# EAGLE design ItalyMap-10 (EAGLE 9.6.2)
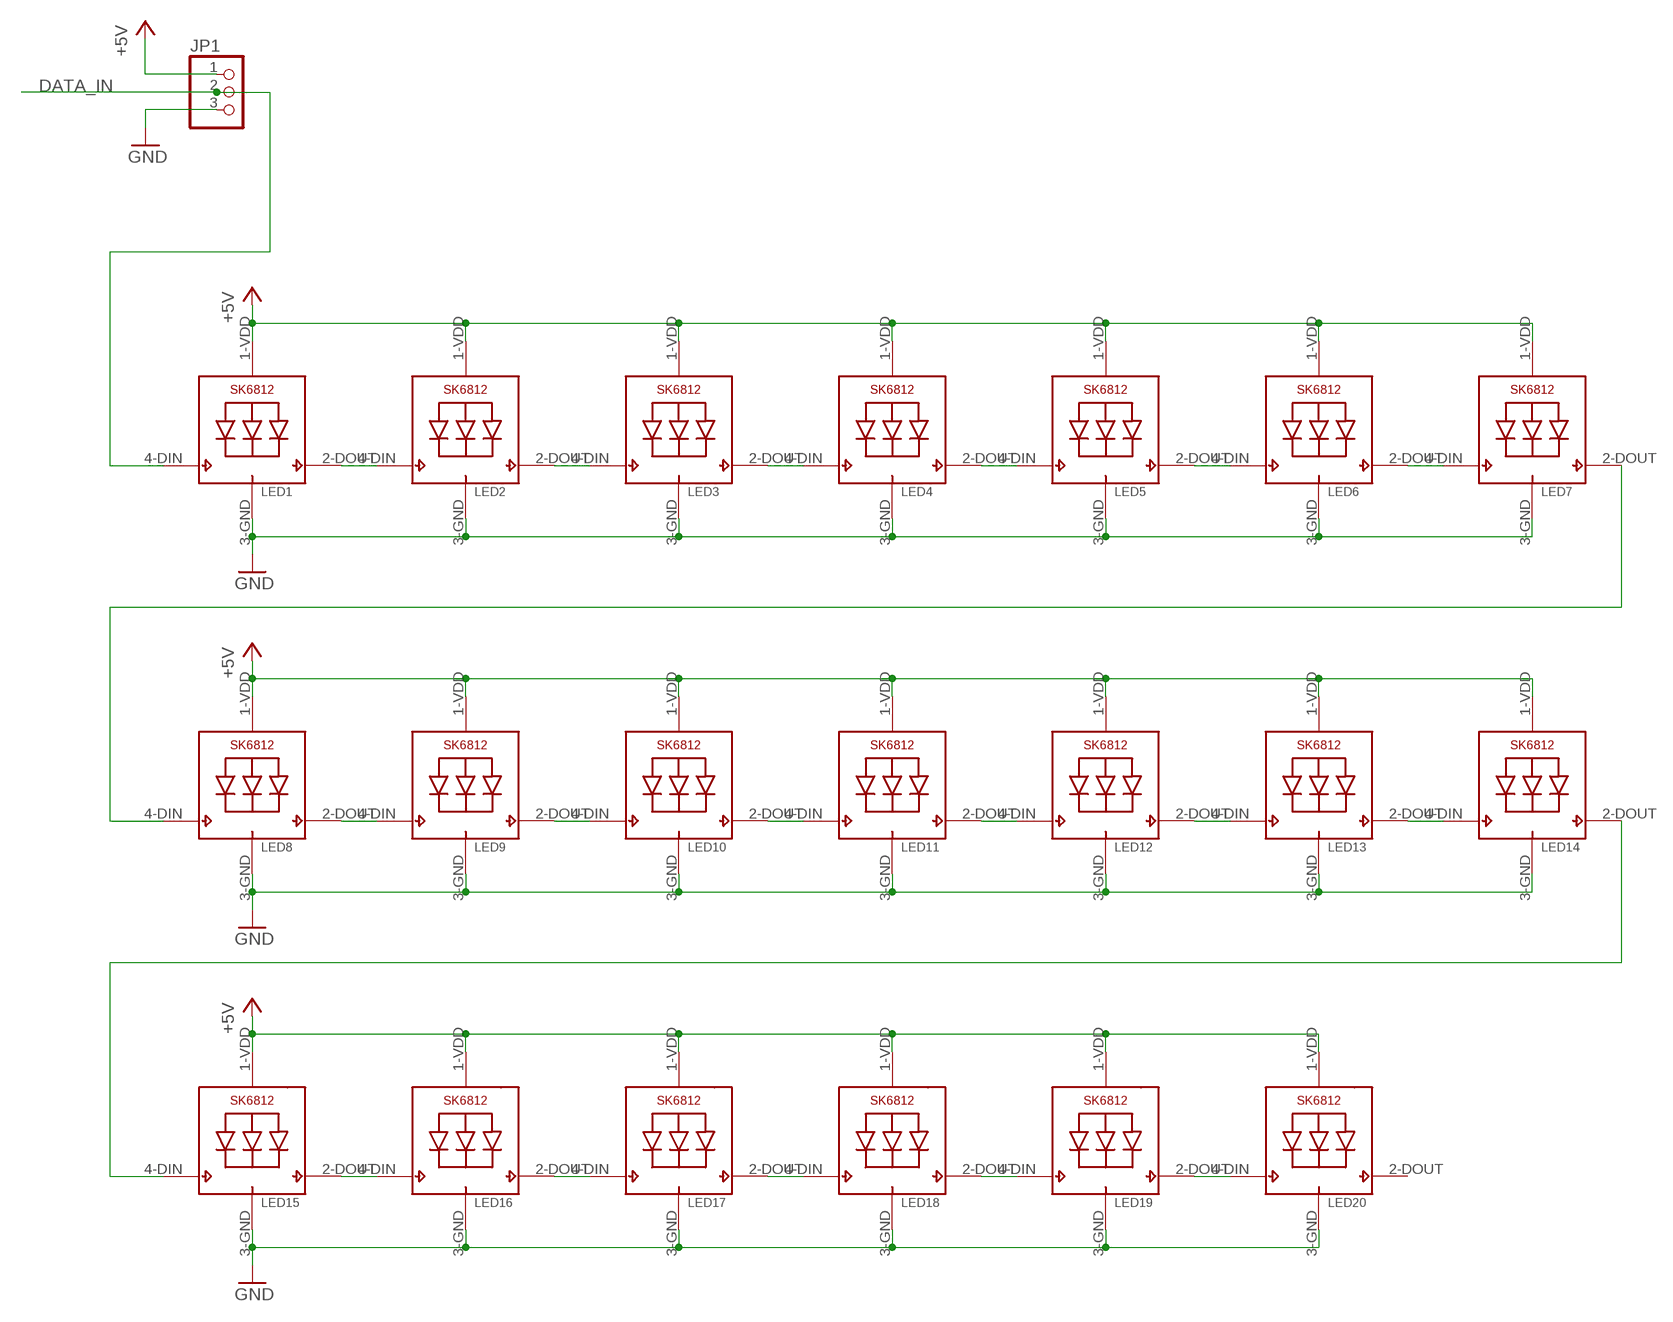
[diagram p0: schematic, sheet 1]

## Parts
JP1  PINHD-1X3  [1X03]
LED1  SK6812  [LED3228]
LED2  SK6812  [LED3228]
LED3  SK6812  [LED3228]
LED4  SK6812  [LED3228]
LED5  SK6812  [LED3228]
LED6  SK6812  [LED3228]
LED7  SK6812  [LED3228]
LED8  SK6812  [LED3228]
LED9  SK6812  [LED3228]
LED10  SK6812  [LED3228]
LED11  SK6812  [LED3228]
LED12  SK6812  [LED3228]
LED13  SK6812  [LED3228]
LED14  SK6812  [LED3228]
LED15  SK6812  [LED3228]
LED16  SK6812  [LED3228]
LED17  SK6812  [LED3228]
LED18  SK6812  [LED3228]
LED19  SK6812  [LED3228]
LED20  SK6812  [LED3228]

## Nets
+5V: JP1.1 LED1.1-VDD(VDD) LED2.1-VDD(VDD) LED3.1-VDD(VDD) LED4.1-VDD(VDD) LED5.1-VDD(VDD) LED6.1-VDD(VDD) LED7.1-VDD(VDD) LED8.1-VDD(VDD) LED9.1-VDD(VDD) LED10.1-VDD(VDD) LED11.1-VDD(VDD) LED12.1-VDD(VDD) LED13.1-VDD(VDD) LED14.1-VDD(VDD) LED15.1-VDD(VDD) LED16.1-VDD(VDD) LED17.1-VDD(VDD) LED18.1-VDD(VDD) LED19.1-VDD(VDD) LED20.1-VDD(VDD)
DATA_IN: JP1.2 LED1.4-DIN(DI)
GND: JP1.3 LED1.3-GND(GND) LED2.3-GND(GND) LED3.3-GND(GND) LED4.3-GND(GND) LED5.3-GND(GND) LED6.3-GND(GND) LED7.3-GND(GND) LED8.3-GND(GND) LED9.3-GND(GND) LED10.3-GND(GND) LED11.3-GND(GND) LED12.3-GND(GND) LED13.3-GND(GND) LED14.3-GND(GND) LED15.3-GND(GND) LED16.3-GND(GND) LED17.3-GND(GND) LED18.3-GND(GND) LED19.3-GND(GND) LED20.3-GND(GND)
N$1: LED7.2-DOUT(DO) LED8.4-DIN(DI)
N$2: LED1.2-DOUT(DO) LED2.4-DIN(DI)
N$3: LED2.2-DOUT(DO) LED3.4-DIN(DI)
N$4: LED3.2-DOUT(DO) LED4.4-DIN(DI)
N$5: LED4.2-DOUT(DO) LED5.4-DIN(DI)
N$6: LED5.2-DOUT(DO) LED6.4-DIN(DI)
N$7: LED6.2-DOUT(DO) LED7.4-DIN(DI)
N$8: LED8.2-DOUT(DO) LED9.4-DIN(DI)
N$9: LED9.2-DOUT(DO) LED10.4-DIN(DI)
N$10: LED10.2-DOUT(DO) LED11.4-DIN(DI)
N$11: LED11.2-DOUT(DO) LED12.4-DIN(DI)
N$12: LED12.2-DOUT(DO) LED13.4-DIN(DI)
N$13: LED13.2-DOUT(DO) LED14.4-DIN(DI)
N$14: LED14.2-DOUT(DO) LED15.4-DIN(DI)
N$15: LED15.2-DOUT(DO) LED16.4-DIN(DI)
N$16: LED16.2-DOUT(DO) LED17.4-DIN(DI)
N$17: LED17.2-DOUT(DO) LED18.4-DIN(DI)
N$18: LED18.2-DOUT(DO) LED19.4-DIN(DI)
N$19: LED19.2-DOUT(DO) LED20.4-DIN(DI)
Unconnected: LED20.2-DOUT(DO)

## Library data of the parts
JP1 = pinhead:PINHD-1X3: PIN HEADER
LED1-LED20 = SK6812:SK6812

## Board
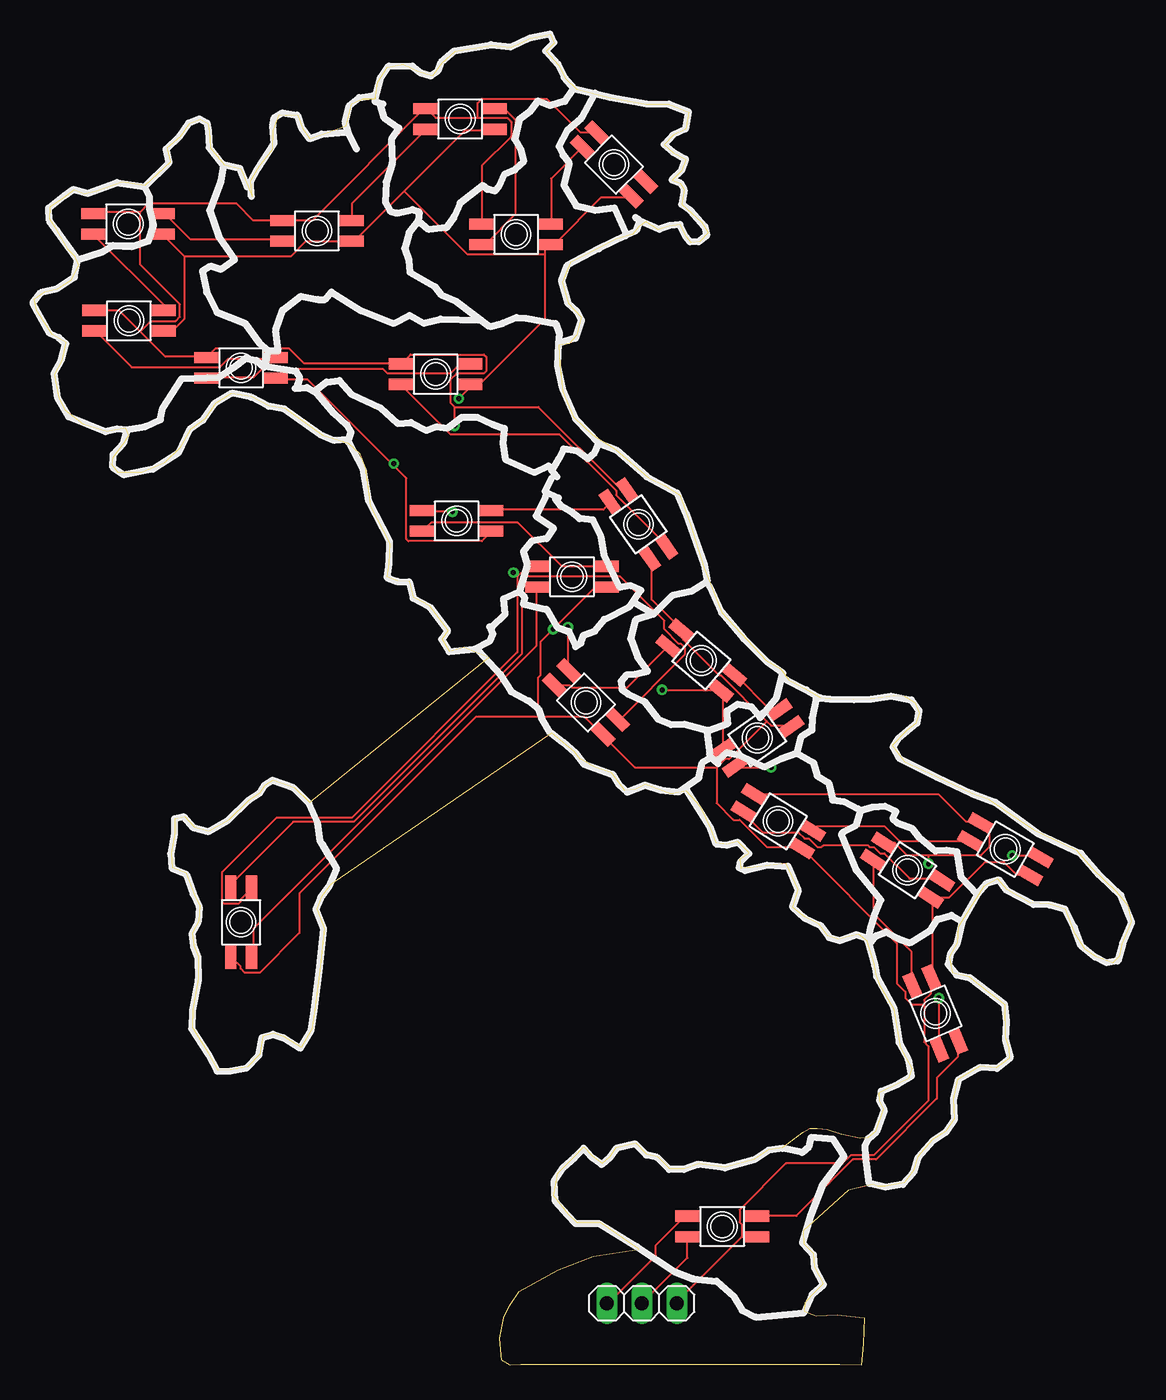
[diagram p1: board, top side]
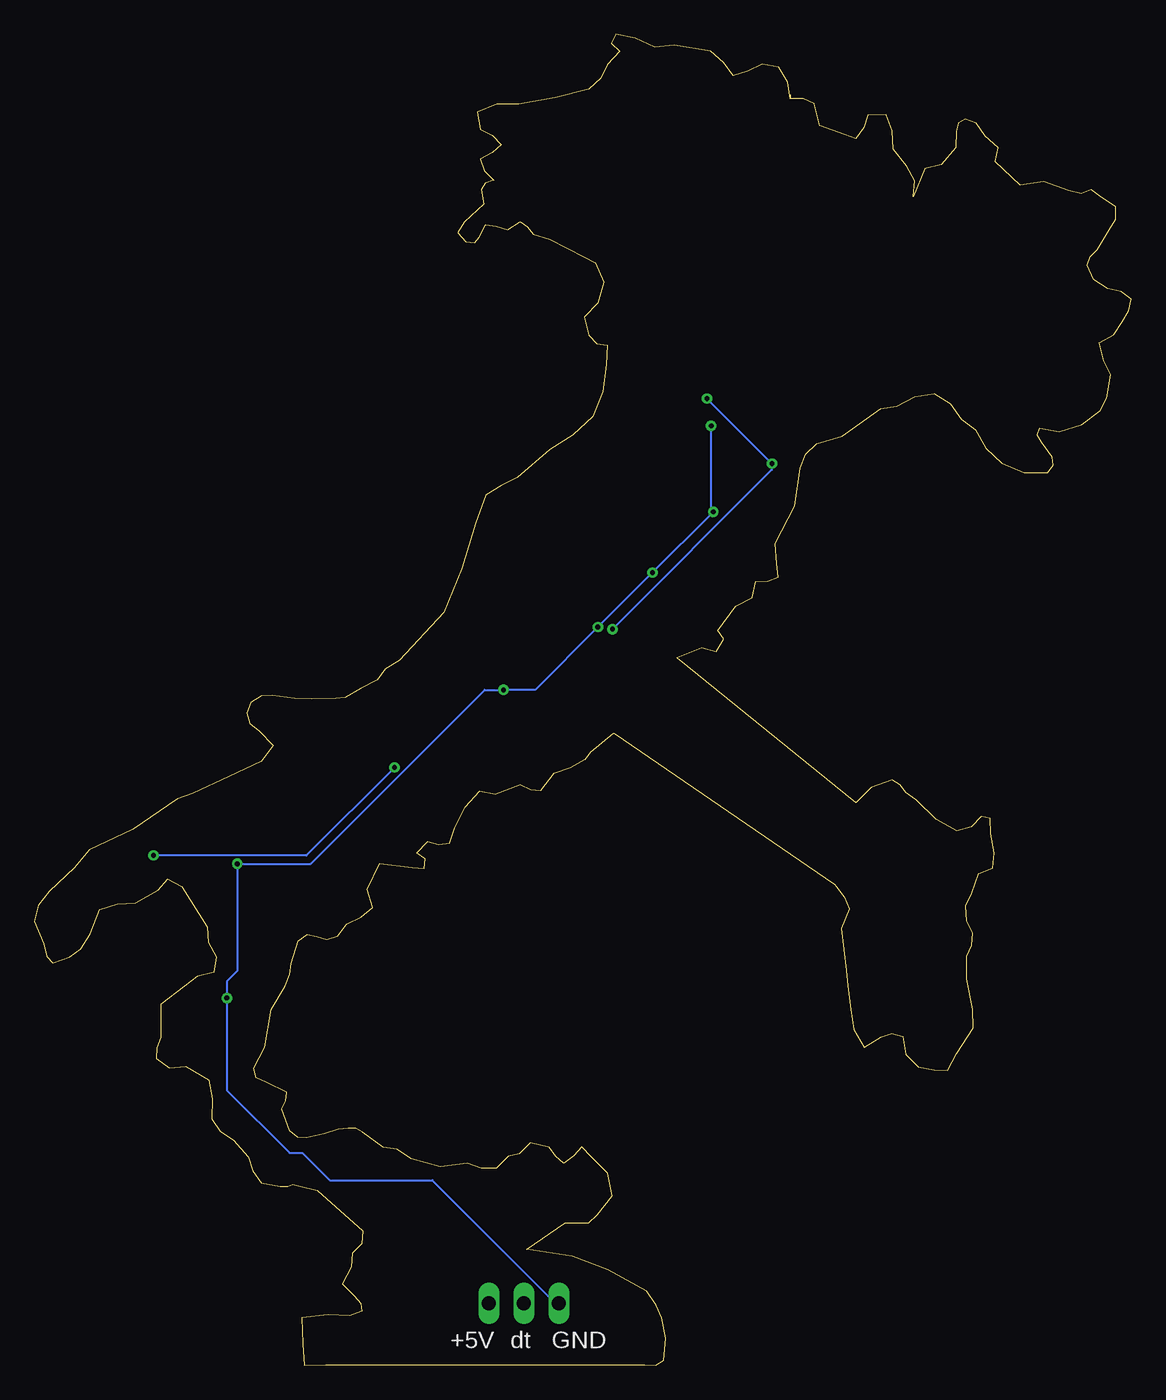
[diagram p2: board, bottom side, seen from below]

Size 79.73 x 96.76 mm. Coordinates in mm from the lower left corner, seen from the top.
Outline: 24.79,92.38 24.79,92.07
Outline: 24.79,92.07 24.98,93.3 25.64,94.38 26.82,94.58 27.89,94.1 28.95,93.74 29.63,94.71 30.58,95.55 33.23,95.98 34.65,95.83 36.04,96.48 37.49,96.76 37.79,96.13 37.2,95.53 38.08,94.57 38.58,93.56 39.43,92.77 41.88,92.16 44.52,91.69 46.14,91.67 47.56,91.1 47.34,89.86 46.44,89.44 45.79,88.73 46.44,88.17 47.34,87.68 47.05,86.85 46.35,86.17 46.95,85.96 47.24,85.46 47.06,84.4 48.5,83.11 48.96,82.33 48.38,81.68 47.73,81.63 47.42,82 46.94,82.92 46.15,82.83 45.34,82.58 44.42,83.16 43.91,82.8 43.48,82.23 42.28,81.89 39.74,80.58 38.95,80.15 38.35,78.76 38.79,77.23 39.76,76.19 39.44,74.88 38.87,74.27 38.11,74.17 38.18,72.74 38.42,70.79 39.16,68.99 40.6,67.62 42.27,66.57 44.62,64.53 45.81,63.95 46.91,63.26 47.64,61.25 48.68,57.94 49.96,54.74 53.2,51.23 54.25,50.61 54.82,49.82 56.01,49.2 57.13,48.55 57.85,48.47 59.58,48.43 60.8,48.46 62.45,48.69 63.24,48.66 64.01,48.17 64.32,47.42 64.07,46.66 63.42,46.16 62.37,45.07 63.24,43.9 65.58,42.79 68.22,41.58 69.34,41.16 72.6,38.96 75.75,37.46 76.85,36.15 78.66,34.45 79.47,33.44 79.74,32.26 79.05,30.63 78.85,29.72 78.39,29.24 77.17,29.68 76.36,30.25 75.66,31.34 74.97,33.13 73.73,33.52 72.39,33.62 70.71,34.54 70.04,35.36 69.01,34.79 67.17,31.85 67.08,30.73 66.5,29.67 66.7,28.54 67.91,28.25 68.84,27.53 70.54,26.23 70.56,23.82 70.83,23.08 70.87,22.3 69.92,21.62 68.73,21.71 67.07,20.74 66.79,19.37 66.86,17.92 66.23,17 65.28,16.37 64.2,15.16 63.88,14.13 63.23,13.27 61.86,13.02 61.31,12.99 60.94,13.14 60.52,13.05 59.17,12.71 55.88,9.78 55.94,8.82 56.62,8.11 56.69,7.16 57.34,5.93 56.49,5.03 56,4.51 55.96,3.9 56.83,3.58 58.37,3.68 60.32,3.46 60.24,1.54 60.12,0.01 58.56,0.01 54.9,0.01 35.37,0.01 34.58,0 33.98,0.34 33.83,1.96 34.12,3.46 34.55,4.36 35.23,5.36 38.06,6.94 40.64,7.9 43.94,8.42
Outline: 24.79,92.07 23.86,92.1 23.07,91.74 22.65,90.14 20.84,89.46 20.02,89.17 19.46,89.97 19.15,90.88 17.8,90.94 17.38,89.77 17.31,88.41 16.33,87.17 15.74,86.12 15.84,84.95 15,87.02 13.82,87.29 12.77,88.52 12.71,89.74 12.6,90.31 12.07,90.6 11.28,90.3 10.63,89.35 9.67,88.51 9.9,87.51 8.07,85.78 6.38,86.04 4.54,85.4 3.63,85.18 2.91,85.48 2.18,84.93 1.15,84.22 1.12,83.32 1.61,82.57 2.48,81.11 2.98,80.6 3.21,79.97 2.72,78.92 1.7,78.26 0.74,78.07 0,77.51 0.18,76.67 0.67,75.89 1.29,74.93 2.33,74.35 2.02,73.05 1.49,72.03 1.79,70.3 2.28,69.39 3.59,68.39 5.26,67.88 6.66,68.12 6.85,67.61 6.53,67.08 5.74,66.03 5.66,65.46 6.09,64.92 7.79,64.9 9.43,65.58 10.56,66.69 11.33,68.03 12.38,68.8 13.15,69.93 14.31,70.66 15.76,70.41 17.06,69.72 18.23,69.54 21.02,67.54 22.85,67.01 23.68,66.25 24.07,65.22 24.45,62.47 25.88,59.72 25.79,58.3 25.66,57.3 26.43,57.01 27.28,56.97 27.57,55.8 28.74,55.18 30.08,53.42 29.64,52.81 30.18,51.9 31.22,52.19 33.02,51.46
Outline: 43.96,8.42 41.15,10.35 39.44,10.34 38.84,10.93 37.74,12.32 38.06,13.95 39.21,15.11 39.94,15.86 40.54,15.2 41.26,14.67 41.85,15.18 42.31,15.83 43.71,16.15 44.49,15.35 45.29,15.18 46.15,14.31 47.24,14.31 48.28,14.67 50.22,14.41 52.35,15.01 53.37,15.7 54.39,15.83 55.86,16.93 56.37,17.21 56.9,17.23 57.63,17.13 58.66,16.83 59.98,16.53 60.61,16.55 61.18,17.03 61.76,18.62 61.45,19.2 61.41,19.82 62.9,20.55 63.6,20.89 63.8,21.58 62.98,23.11 62.52,25.85 61.49,27.58 61.19,28.39 61.05,29.21 60.56,30.84 59.91,31.31 59.22,31.16 58.47,30.94 57.68,31.21 57.02,32.1 55.98,32.58 55.13,33.29 55.53,34.6 54.64,36.47 52.25,36.19 51.39,36.1 51.31,36.8 51.95,37.24 51.13,38.09 50.34,37.87 49.55,37.95 49.17,39.08 48.43,40.59 47.37,41.76 46.25,41.55 44.42,42.22 43.66,41.86 42.91,41.8 41.96,43.07 40.78,43.46 39.69,44.06
Outline: 21.45,34.81 20.86,34.04 20.52,33.18 21.08,31.75 20.74,28.7 20.61,27.58 20.39,25.85 20.17,24.4 19.4,23.11 18.18,23.87 17.41,24.12 16.61,23.89 16.38,22.6 15.49,21.67 14.31,21.46 13.35,21.43 12.69,22.68 11.5,24.53 11.54,25.85 11.96,28.09 11.95,29.72 11.61,30.53 11.51,31.44 11.97,32.29 12.04,33.38 11.6,34.3 11.09,35.75 10.06,36.17 9.98,37.24 10.23,38.67 10.24,39.76 10.91,39.91 11.63,39.12 12.68,38.83 14.18,39.68 15.62,41.1 16.4,41.63 16.78,42.2 17.36,42.56 18.89,42 20.01,40.91
Outline: 33.03,51.46 20.03,40.92
Outline: 39.69,44.04 39.28,44.58 37.61,45.95 21.55,34.95 21.45,34.8
Copper layers (1*16): Top 0.035mm / dielectric 1.5mm / Bottom 0.035mm
Design rules "default": minimum track width 6mil, minimum drill 0.35mm, track to track 6mil, track to pad 6mil, pad to pad 6mil, via to via 6mil, smd to smd 6mil, copper to edge 40mil, drill to drill 6mil, minimum pad ring 10mil, minimum via ring 8mil, stop-mask expansion 4mil, vias tented up to drill 0mil, thermal gap 10mil

### Footprints (pad centres in the part's own frame; a part is rotated, then mirrored left to right if it is on the bottom)
1X03 = drill 1.016 long: 1 -2.54,0; 2 0,0; 3 2.54,0
LED3228 = smd 1.8 x 0.82: 1-VDD 2.5,-0.75; 2-DOUT 2.5,0.75; 3-GND -2.5,0.75; 4-DIN -2.5,-0.75

### Placement (x,y rotation side)
JP1  44.16,4.5 180 top
LED1  50,10.08 0 top
LED2  65.49,25.58 113 top
LED3  63.46,35.99 327 top
LED4  54.06,39.55 328 top
LED5  70.57,37.52 330 top
LED6  52.55,45.6 35 top
LED7  48.48,51.23 140 top
LED8  40.09,48.18 315 top
LED9  15.02,32.21 270 top
LED10  39.08,57.33 0 top
LED11  30.7,61.39 0 top
LED12  43.9,61.14 305 top
LED13  29.17,72.06 0 top
LED14  15.02,72.52 0 top
LED15  6.87,75.95 0 top
LED16  6.82,82.98 0 top
LED17  20.54,82.47 0 top
LED18  30.95,90.6 0 top
LED19  35.01,82.22 0 top
LED20  42.13,87.3 315 top

### Tracks (layer width: path | path; a pad name or v marks a point on that pad's centre or on a via)
+5V  (via drill 0.35)
  Top 0.152: 25.97,65.56 27.04,64.49 27.04,60.07 27.19,59.92 32.53,59.92 33.13,60.53 LED11.1-VDD | 25.97,65.56 19.88,71.65 17.59,71.65 LED14.1-VDD | 37.1,80.8 37.1,81.1 37.4,81.41 LED19.1-VDD 37.55,81.56 37.86,81.56 41.21,84.91 43.35,84.91 LED20.1-VDD | 37.1,80.8 37.1,76.07 32.37,71.35 31.76,71.35 LED13.1-VDD 31.76,71.2 v30.85,70.28 | 10.88,80.65 10.88,76.07 10.12,75.31 9.51,75.31 LED15.1-VDD | 10.88,80.65 9.36,82.17 LED16.1-VDD | 10.88,80.65 18.66,80.65 19.72,81.71 22.92,81.71 LED17.1-VDD 23.08,81.86 23.38,81.86 26.89,85.37 | 26.89,85.37 31.31,89.79 33.44,89.79 LED18.1-VDD | 37.1,80.8 31.46,80.8 26.89,85.37 | v26.12,65.56 25.97,65.56 | 51.42,9.32 52.49,9.32 LED1.1-VDD | 51.42,9.32 46.7,4.6 JP1.1 | LED5.1-VDD 72.3,35.69 71.39,35.69 70.47,36.6 69.1,36.6 66.51,34.01 65.29,34.01 LED3.1-VDD 65.29,33.86 65.29,28.22 LED2.1-VDD 65.14,28.07 65.14,27 64.68,26.54 64.68,26.24 | 51.42,9.32 51.42,10.24 51.27,10.39 51.27,11.3 54.62,14.66 58.74,14.66 59.35,15.27 61.02,15.27 64.99,19.23 64.99,23.19 64.68,23.5 64.68,26.24 | LED12.1-VDD 44.87,58.55 44.87,55.65 47,53.52 LED7.1-VDD 47.16,53.37 47.16,52.76 49.75,50.17 49.9,50.17 53.25,46.81 | 53.25,46.81 53.56,46.51 54.93,46.51 LED6.1-VDD | 49.59,43.46 49.59,40.87 50.81,39.65 51.27,39.65 53.25,37.67 55.69,37.67 LED4.1-VDD 55.84,37.52 62.7,30.66 62.7,27.76 63.31,27.15 63.31,26.7 63.77,26.24 64.68,26.24 | 49.59,43.46 50.2,44.07 50.51,44.07 53.25,46.81 | 36.64,47.12 39.99,47.12 41.21,45.9 LED8.1-VDD 41.36,45.75 43.65,43.46 49.59,43.46 | 36.64,47.12 32.07,47.12 19.27,34.32 19.27,31.42 16.37,28.52 15.3,28.52 15,28.83 15,28.98 14.39,29.59 LED9.1-VDD
  Top 0.152: 36.64,47.12 36.64,50.01 36.79,50.17 36.79,52.6 v37.71,53.52 40.75,56.57 41.52,56.57 LED10.1-VDD
  Bottom 0.152: v30.85,70.28 v26.12,65.56 26.12,65.1 v37.71,53.52
DATA_IN
  Top 0.152: JP1.2 47.46,7.8 47.46,9.32 LED1.4-DIN
GND  (via drill 0.35)
  Top 0.152: 32.22,90.7 29.17,90.7 28.56,91.31 LED18.3-GND 28.41,91.47 20.18,83.24 18.05,83.24 LED17.3-GND 17.89,83.24 15.91,83.24 14.69,84.46 8.29,84.46 7.68,83.85 | 32.22,90.7 34.35,90.7 34.66,90.4 34.66,89.33 32.53,87.2 32.53,83.08 LED19.3-GND | 7.68,83.85 4.33,83.85 LED16.3-GND | 32.22,90.7 32.22,91.77 32.53,92.08 37.25,92.08 39.69,89.64 40.75,89.64 LED20.3-GND | 7.68,75.16 9.51,73.33 12.41,73.33 LED14.3-GND 12.56,73.33 13.17,73.94 18.5,73.94 19.57,72.87 26.58,72.87 LED13.3-GND 26.73,72.87 27.34,73.48 32.68,73.48 32.83,73.33 32.83,72.26 32.68,72.11 30.7,72.11 30.24,71.65 30.24,69.98 30.54,69.67 | 7.68,75.16 6.16,76.68 4.48,76.68 LED15.3-GND | 30.54,69.67 36.64,69.67 42.58,63.73 43.04,63.73 LED12.3-GND | 7.68,83.85 7.68,80.04 10.58,77.14 10.58,76.23 10.27,75.92 8.45,75.92 7.68,75.16 | LED6.3-GND 50.05,44.83 50.05,48.95 LED7.3-GND 49.9,49.1 v45.63,49.1 | 35.12,57.33 35.12,51.84 23.08,39.8 17.59,39.8 13.63,35.84 13.63,33.71 13.78,33.55 14.85,33.55 15,33.71 15,33.86 15.76,34.62 LED9.3-GND | 35.12,57.33 35.73,57.94 36.49,57.94 LED10.3-GND | v30.39,62.05 28.26,62.05 LED11.3-GND | 35.12,57.33 v34.81,57.63 | v38.77,53.67 38.77,50.62 LED8.3-GND | LED1.3-GND 47.46,10.69 47.16,10.69 45.17,8.71 45.17,7.95 41.67,4.45 JP1.3 | 64.99,37.06 68.8,37.06 69.41,37.67 69.41,38.74 68.8,39.35 LED5.3-GND 68.64,39.5 67.73,39.5 65.75,41.48 52.49,41.48 LED4.3-GND | 64.99,37.06 63.46,37.06 62.55,37.97 61.79,37.97 LED3.3-GND | v65.75,26.7 65.75,23.04 LED2.3-GND | 64.99,37.06 v64.99,36.45 | v30.54,68.3 30.54,69.67
  Bottom 0.152: 30.54,61.9 v34.81,57.63 v38.77,53.67 43.35,49.1 v45.63,49.1 47,49.1 59.65,36.45 v64.99,36.45 64.99,28.68 65.75,27.92 v65.75,26.7 65.75,19.99 61.18,15.42 60.26,15.42 58.28,13.44 50.81,13.44 41.97,4.6 41.67,4.6 JP1.3 | 30.54,61.9 v30.54,68.3 | 30.54,61.9 v30.39,62.05
N$1
  Top 0.152: LED8.4-DIN 37.86,49.4 38.93,49.4 39.08,49.25 43.04,49.25 45.94,52.15 LED7.2-DOUT
N$2
  Top 0.152: LED1.2-DOUT 52.64,10.85 55.39,10.85 59.5,14.96 61.18,14.96 65.6,19.38 65.6,20.9 67.12,22.43 67.12,23.5 LED2.4-DIN
N$3
  Top 0.152: LED3.4-DIN 61.02,36.6 61.02,32.79 63.77,30.05 63.77,27.61 LED2.2-DOUT
N$4
  Top 0.152: LED3.2-DOUT 65.9,35.38 63.61,35.38 61.79,37.21 61.48,37.21 61.02,37.67 60.72,37.67 60.57,37.82 57.37,37.82 57.21,37.67 56.91,37.67 56.3,38.28 55.99,38.28 55.54,38.74 52.95,38.74 51.58,40.11 LED4.4-DIN
N$5
  Top 0.152: LED5.4-DIN 67.88,38.13 62.85,38.13 61.79,39.19 56.91,39.19 56.6,38.89 LED4.2-DOUT
N$6  (via drill 0.35)
  Top 0.152: v71.08,37.06 73.06,37.06 LED5.2-DOUT | v53.56,43.46 50.97,43.46 LED6.4-DIN
  Bottom 0.152: v71.08,37.06 59.96,37.06 v53.56,43.46
N$7
  Top 0.152: LED6.2-DOUT 54.01,47.73 53.4,47.73 50.97,50.17 LED7.4-DIN
N$8
  Top 0.152: LED9.4-DIN 14.39,34.77 14.39,35.08 18.81,39.5 23.23,39.5 35.42,51.69 35.42,57.18 35.57,57.33 42.58,57.33 45.78,54.13 45.78,53.52 46.85,52.45 47,52.45 47.31,52.15 47.31,51.69 42.43,46.81 LED8.2-DOUT
N$9
  Top 0.152: LED9.2-DOUT 15.91,29.74 15.91,31.73 36.49,52.3 36.49,56.57 LED10.4-DIN
N$10
  Top 0.152: LED10.2-DOUT 41.52,58.09 38.32,58.09 35.12,61.29 28.87,61.29 28.26,60.68 LED11.4-DIN
N$11
  Top 0.152: LED11.2-DOUT 33.29,62.21 41.36,62.21 41.82,62.66 LED12.4-DIN
N$12
  Top 0.152: LED12.2-DOUT 45.94,59.61 42.28,63.27 42.28,63.58 38.16,67.69 30.24,67.69 26.73,71.2 LED13.4-DIN
N$13
  Top 0.152: LED14.4-DIN 12.56,71.81 15.91,71.81 16.52,72.42 25.36,72.42 25.67,72.11 30.24,72.11 30.85,72.72 31.61,72.72 LED13.2-DOUT
N$14
  Top 0.152: LED14.2-DOUT 17.44,73.18 14.08,73.18 13.48,72.57 7.07,72.57 4.48,75.16 LED15.4-DIN
N$15
  Top 0.152: LED15.2-DOUT 9.36,76.84 9.36,77.14 4.33,82.17 LED16.4-DIN
N$16
  Top 0.152: LED17.4-DIN 17.89,81.86 11.34,81.86 9.36,83.85 LED16.2-DOUT
N$17
  Top 0.152: LED17.2-DOUT 23.08,83.24 23.08,84.46 28.41,89.79 LED18.4-DIN
N$18
  Top 0.152: LED19.4-DIN 32.53,81.56 32.83,81.56 34.96,83.69 34.96,90.55 34.2,91.31 33.59,91.31 LED18.2-DOUT
N$19
  Top 0.152: LED19.2-DOUT 37.55,83.08 37.55,86.28 39.69,88.42 LED20.4-DIN

### Text on the board
bPlace: dt | GND | +5V